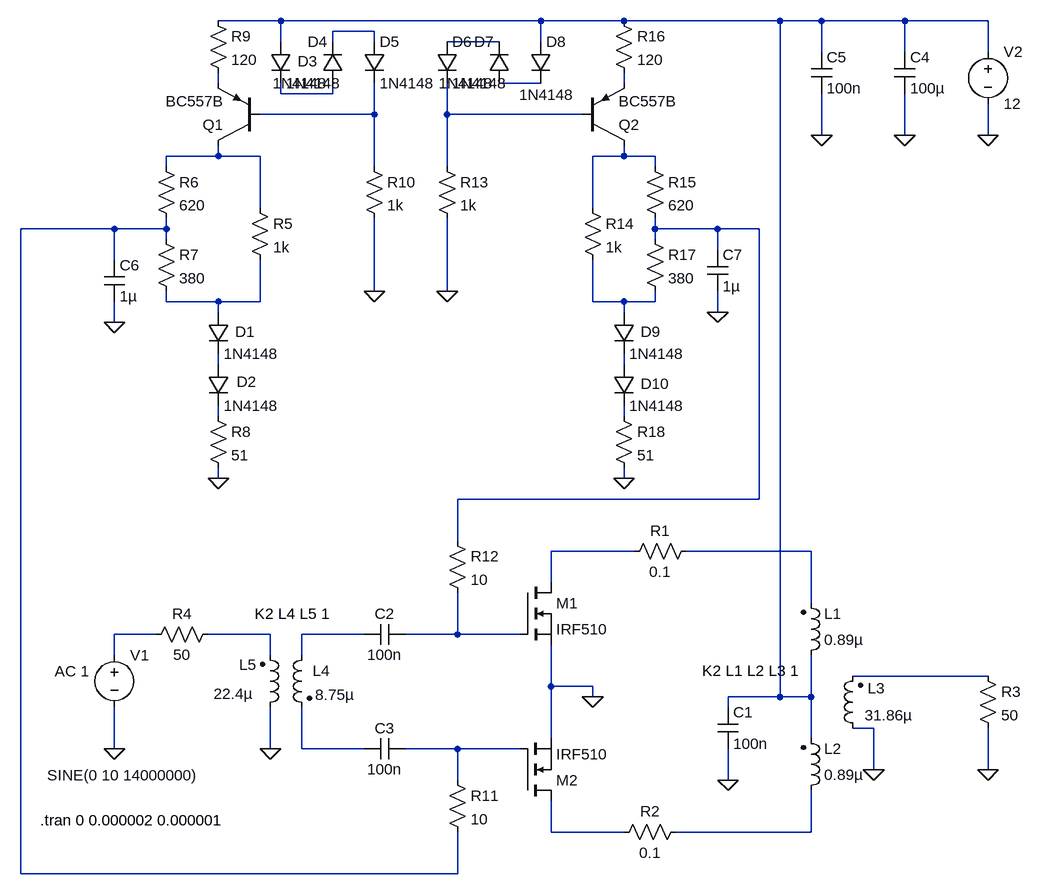
[diagram p0: schematic Power Amplifier.asc]
Power Amplifier.asc, the LTspice schematic file:
Version 4
SHEET 1 1200 680
WIRE -224 -768 -320 -768
WIRE 176 -768 -224 -768
WIRE 304 -768 176 -768
WIRE 544 -768 304 -768
WIRE 608 -768 544 -768
WIRE 736 -768 608 -768
WIRE 864 -768 736 -768
WIRE -80 -752 -144 -752
WIRE -224 -736 -224 -768
WIRE -144 -736 -144 -752
WIRE -80 -736 -80 -752
WIRE 112 -736 32 -736
WIRE 176 -736 176 -768
WIRE 608 -720 608 -768
WIRE 736 -720 736 -768
WIRE 864 -720 864 -768
WIRE -320 -672 -320 -688
WIRE 176 -672 112 -672
WIRE 304 -672 304 -688
WIRE -224 -656 -224 -672
WIRE -144 -656 -144 -672
WIRE -144 -656 -224 -656
WIRE -80 -624 -80 -672
WIRE -80 -624 -256 -624
WIRE 32 -624 32 -672
WIRE 240 -624 32 -624
WIRE 608 -592 608 -656
WIRE 736 -592 736 -656
WIRE 864 -592 864 -640
WIRE -320 -560 -320 -576
WIRE -320 -560 -400 -560
WIRE -256 -560 -320 -560
WIRE 304 -560 304 -576
WIRE 304 -560 256 -560
WIRE 352 -560 304 -560
WIRE -400 -544 -400 -560
WIRE -80 -544 -80 -624
WIRE 32 -544 32 -624
WIRE 352 -544 352 -560
WIRE -256 -480 -256 -560
WIRE 256 -480 256 -560
WIRE -480 -448 -624 -448
WIRE -400 -448 -400 -464
WIRE -400 -448 -480 -448
WIRE 352 -448 352 -464
WIRE 448 -448 352 -448
WIRE 512 -448 448 -448
WIRE -400 -432 -400 -448
WIRE 352 -432 352 -448
WIRE 448 -416 448 -448
WIRE -480 -400 -480 -448
WIRE -80 -352 -80 -464
WIRE 32 -352 32 -464
WIRE -400 -336 -400 -352
WIRE -320 -336 -400 -336
WIRE -256 -336 -256 -400
WIRE -256 -336 -320 -336
WIRE 256 -336 256 -400
WIRE 304 -336 256 -336
WIRE 352 -336 352 -352
WIRE 352 -336 304 -336
WIRE -320 -320 -320 -336
WIRE 304 -320 304 -336
WIRE 448 -320 448 -352
WIRE -480 -304 -480 -336
WIRE -320 -240 -320 -256
WIRE 304 -240 304 -256
WIRE -320 -160 -320 -176
WIRE 304 -160 304 -176
WIRE -320 -64 -320 -80
WIRE 304 -64 304 -80
WIRE 512 -32 512 -448
WIRE 512 -32 48 -32
WIRE 48 32 48 -32
WIRE 320 48 192 48
WIRE 592 48 400 48
WIRE 192 96 192 48
WIRE 592 128 592 48
WIRE -416 176 -480 176
WIRE -240 176 -336 176
WIRE -96 176 -192 176
WIRE 48 176 48 112
WIRE 48 176 -32 176
WIRE 144 176 48 176
WIRE -480 208 -480 176
WIRE -240 208 -240 176
WIRE -192 208 -192 176
WIRE 864 240 656 240
WIRE 192 256 192 192
WIRE 256 256 192 256
WIRE 256 272 256 256
WIRE 544 272 544 -768
WIRE 544 272 464 272
WIRE 592 272 592 208
WIRE 592 272 544 272
WIRE 464 288 464 272
WIRE 688 320 656 320
WIRE 192 336 192 256
WIRE 592 336 592 272
WIRE -480 352 -480 288
WIRE -240 352 -240 288
WIRE -192 352 -192 288
WIRE -96 352 -192 352
WIRE 48 352 -32 352
WIRE 144 352 48 352
WIRE 688 384 688 320
WIRE 864 384 864 320
WIRE 48 400 48 352
WIRE 464 400 464 352
WIRE 192 480 192 432
WIRE 304 480 192 480
WIRE 592 480 592 416
WIRE 592 480 384 480
WIRE -624 544 -624 -448
WIRE 48 544 48 480
WIRE 48 544 -624 544
FLAG 256 272 0
FLAG 464 400 0
FLAG 688 384 0
FLAG 864 384 0
FLAG -240 352 0
FLAG -480 352 0
FLAG 864 -592 0
FLAG 736 -592 0
FLAG 608 -592 0
FLAG -320 -64 0
FLAG -480 -304 0
FLAG -80 -352 0
FLAG 32 -352 0
FLAG 448 -320 0
FLAG 304 -64 0
SYMBOL nmos 144 96 R0
SYMATTR InstName M1
SYMATTR Value IRF510
SYMBOL nmos 144 432 M180
SYMATTR InstName M2
SYMATTR Value IRF510
SYMBOL ind2 576 224 M180
WINDOW 0 36 80 Left 2
WINDOW 3 36 40 Left 2
SYMATTR InstName L1
SYMATTR Value 0.89µ
SYMATTR Type ind
SYMBOL ind2 576 432 M180
WINDOW 0 36 80 Left 2
WINDOW 3 36 40 Left 2
SYMATTR InstName L2
SYMATTR Value 0.89µ
SYMATTR Type ind
SYMBOL ind2 672 336 R180
WINDOW 0 -34 77 Left 2
WINDOW 3 -77 36 Left 2
SYMATTR InstName L3
SYMATTR Value 31.86µ
SYMATTR Type ind
SYMBOL res 416 32 R90
WINDOW 0 0 56 VBottom 2
WINDOW 3 32 56 VTop 2
SYMATTR InstName R1
SYMATTR Value 0.1
SYMBOL res 400 464 R90
WINDOW 0 0 56 VBottom 2
WINDOW 3 32 56 VTop 2
SYMATTR InstName R2
SYMATTR Value 0.1
SYMBOL cap 448 288 R0
SYMATTR InstName C1
SYMATTR Value 100n
SYMBOL res 848 224 R0
SYMATTR InstName R3
SYMATTR Value 50
SYMBOL cap -32 160 R90
WINDOW 0 0 32 VBottom 2
WINDOW 3 32 32 VTop 2
SYMATTR InstName C2
SYMATTR Value 100n
SYMBOL cap -32 336 R90
WINDOW 0 0 32 VBottom 2
WINDOW 3 32 32 VTop 2
SYMATTR InstName C3
SYMATTR Value 100n
SYMBOL ind2 -176 192 M0
WINDOW 0 -28 40 Left 2
WINDOW 3 -66 77 Left 2
SYMATTR InstName L4
SYMATTR Value 8.75µ
SYMATTR Type ind
SYMBOL ind2 -256 304 M180
WINDOW 0 -32 81 Left 2
WINDOW 3 -71 37 Left 2
SYMATTR InstName L5
SYMATTR Value 22.4µ
SYMATTR Type ind
SYMBOL voltage -480 192 R0
WINDOW 3 -103 201 Left 2
WINDOW 123 -92 41 Left 2
WINDOW 39 0 0 Left 2
SYMATTR InstName V1
SYMATTR Value SINE(0 10 14000000)
SYMATTR Value2 AC 1
SYMBOL res -320 160 R90
WINDOW 0 0 56 VBottom 2
WINDOW 3 32 56 VTop 2
SYMATTR InstName R4
SYMATTR Value 50
SYMBOL voltage 864 -736 R0
WINDOW 123 0 0 Left 2
WINDOW 39 0 0 Left 2
SYMATTR InstName V2
SYMATTR Value 12
SYMBOL cap 720 -720 R0
SYMATTR InstName C4
SYMATTR Value 100µ
SYMBOL cap 592 -720 R0
SYMATTR InstName C5
SYMATTR Value 100n
SYMBOL diode -336 -320 R0
WINDOW 0 42 30 Left 2
SYMATTR InstName D1
SYMATTR Value 1N4148
SYMBOL pnp -256 -576 R180
SYMATTR InstName Q1
SYMATTR Value BC557B
SYMBOL res -272 -496 R0
SYMATTR InstName R5
SYMATTR Value 1k
SYMBOL res -416 -560 R0
SYMATTR InstName R6
SYMATTR Value 620
SYMBOL res -416 -448 R0
SYMATTR InstName R7
SYMATTR Value 380
SYMBOL diode -336 -240 R0
WINDOW 0 44 27 Left 2
SYMATTR InstName D2
SYMATTR Value 1N4148
SYMBOL res -336 -176 R0
SYMATTR InstName R8
SYMATTR Value 51
SYMBOL cap -496 -400 R0
SYMATTR InstName C6
SYMATTR Value 1µ
SYMBOL res -336 -784 R0
SYMATTR InstName R9
SYMATTR Value 120
SYMBOL diode -240 -736 R0
WINDOW 0 42 30 Left 2
SYMATTR InstName D3
SYMATTR Value 1N4148
SYMBOL diode -128 -672 R180
WINDOW 0 24 64 Left 2
WINDOW 3 24 0 Left 2
SYMATTR InstName D4
SYMATTR Value 1N4148
SYMBOL diode -96 -736 R0
SYMATTR InstName D5
SYMATTR Value 1N4148
SYMBOL res -96 -560 R0
SYMATTR InstName R10
SYMATTR Value 1k
SYMBOL res 32 384 R0
SYMATTR InstName R11
SYMATTR Value 10
SYMBOL res 32 16 R0
SYMATTR InstName R12
SYMATTR Value 10
SYMBOL diode 16 -736 R0
SYMATTR InstName D6
SYMATTR Value 1N4148
SYMBOL diode 128 -672 R180
WINDOW 0 24 64 Left 2
WINDOW 3 24 0 Left 2
SYMATTR InstName D7
SYMATTR Value 1N4148
SYMBOL diode 160 -736 R0
WINDOW 3 -17 82 Left 2
SYMATTR InstName D8
SYMATTR Value 1N4148
SYMBOL res 16 -560 R0
SYMATTR InstName R13
SYMATTR Value 1k
SYMBOL res 240 -496 R0
SYMATTR InstName R14
SYMATTR Value 1k
SYMBOL res 336 -560 R0
SYMATTR InstName R15
SYMATTR Value 620
SYMBOL pnp 240 -576 M180
SYMATTR InstName Q2
SYMATTR Value BC557B
SYMBOL res 288 -784 R0
SYMATTR InstName R16
SYMATTR Value 120
SYMBOL res 336 -448 R0
SYMATTR InstName R17
SYMATTR Value 380
SYMBOL cap 432 -416 R0
SYMATTR InstName C7
SYMATTR Value 1µ
SYMBOL diode 288 -320 R0
WINDOW 0 42 30 Left 2
SYMATTR InstName D9
SYMATTR Value 1N4148
SYMBOL diode 288 -240 R0
WINDOW 0 42 30 Left 2
SYMATTR InstName D10
SYMATTR Value 1N4148
SYMBOL res 288 -176 R0
SYMATTR InstName R18
SYMATTR Value 51
TEXT 424 232 Left 2 !K2 L1 L2 L3 1
TEXT -264 144 Left 2 !K2 L4 L5 1
TEXT -594 462 Left 2 !.tran 0 0.000002 0.000001

The netlist it stands for:
* Power Amplifier.asc
M1 N020 N025 0 0 IRF510
M2 N029 N028 0 0 IRF510
L1 N001 N021 0.89µ
L2 N030 N001 0.89µ
L3 0 N026 31.86µ
R1 N021 N020 0.1
R2 N030 N029 0.1
C1 N001 0 100n
R3 N026 0 50
C2 N025 N024 100n
C3 N028 N027 100n
L4 N024 N027 8.75µ
L5 0 N023 22.4µ
V1 N022 0 SINE(0 10 14000000) AC 1
R4 N023 N022 50
V2 N001 0 12
C4 N001 0 100µ
C5 N001 0 100n
D1 N014 N016 1N4148
Q1 N010 N008 N004 0 BC557B
R5 N010 N014 1k
R6 N010 N012 620
R7 N012 N014 380
D2 N016 N018 1N4148
R8 N018 0 51
C6 N012 0 1µ
R9 N001 N004 120
D3 N001 N007 1N4148
D4 N007 N002 1N4148
D5 N002 N008 1N4148
R10 N008 0 1k
R11 N028 N012 10
R12 N013 N025 10
D6 N003 N009 1N4148
D7 N005 N003 1N4148
D8 N001 N005 1N4148
R13 N009 0 1k
R14 N011 N015 1k
R15 N011 N013 620
Q2 N011 N009 N006 0 BC557B
R16 N001 N006 120
R17 N013 N015 380
C7 N013 0 1µ
D9 N015 N017 1N4148
D10 N017 N019 1N4148
R18 N019 0 51
.model D D
.lib standard.dio
.model NPN NPN
.model PNP PNP
.lib standard.bjt
.model NMOS NMOS
.model PMOS PMOS
.lib standard.mos
K2 L1 L2 L3 1
K2 L4 L5 1
.tran 0 0.000002 0.000001
.backanno
.end